# Altium schematic sheet fuelCell_page2.SchDoc
size A4; SheetNumber: 2; SheetTotal: 2
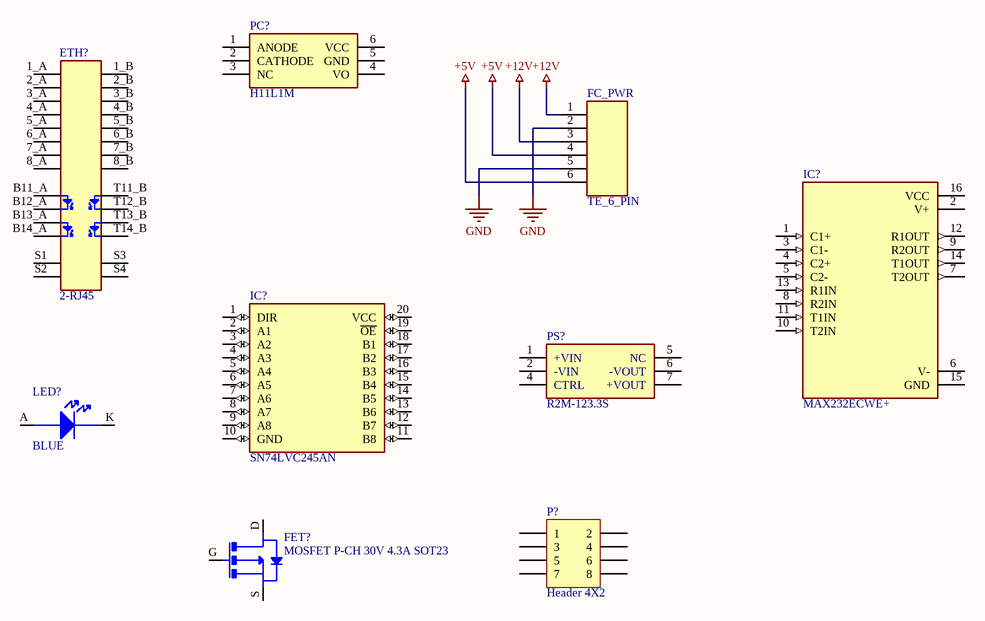
[diagram p0: fuelCell_page2.SchDoc]

## Parts
(Parts that share a designator on the sheet are numbered #1, #2 ... from top to bottom, then left to right.)
ETH?  2-RJ45  [RJ45]
FC_PWR  TE_6_PIN  [TE_6_PIN]
FET?  MOSFET P-CH 30V 4.3A SOT23  [MOSFET P-CH 30V 4.3A SOT23]
IC?#1  MAX232ECWE+  [MAX232ECWE+]
IC?#2  SN74LVC245AN  [SN74LVC245AN]
LED?  BLUE  [LED]
P?  Header 4X2  [HDR2X4]
PC?  H11L1M  [H11L1M]
PS?  R2M-123.3S  [R2M-123.3S]

## Nets
+5V: FC_PWR.4 FC_PWR.6
+12V: FC_PWR.1 FC_PWR.3
GND: FC_PWR.2 FC_PWR.5

Not connected (* = marked no-connect by the designer): ETH? 1_A(+) 1_B(SHIELD) 2_A(+) 2_B(SHIELD) 3_A(+) 3_B(SHIELD) 4_A(+) 4_B(SHIELD) 5_A(+) 5_B(SHIELD) 6_A(+) 6_B(SHIELD) 7_A(+) 7_B(SHIELD) 8_A(+) 8_B(SHIELD) B11_A(9) B12_A(10) B13_A(11) B14_A(12) S1(13) S2(13) S3(SHIELD) S4(SHIELD) T11_B(SHIELD) T12_B(SHIELD) T13_B(B13_B) T14_B(SHIELD); FET? D G S; IC?#1 1(C1+) 2(V+) 3(C1-) 4(C2+) 5(C2-) 6(V-) 7(T2OUT) 8(R2IN) 9(R2OUT) 10(T2IN) 11(T1IN) 12(R1OUT) 13(R1IN) 14(T1OUT) 15(GND) 16(VCC); IC?#2 1(DIR) 2(A1) 3(A2) 4(A3) 5(A4) 6(A5) 7(A6) 8(A7) 9(A8) 10(GND) 11(B8) 12(B7) 13(B6) 14(B5) 15(B4) 16(B3) 17(B2) 18(B1) 19(~{OE}) 20(VCC); LED? A(S) K(S); P? 1 2 3 4 5 6 7 8; PC? 1(SHIELD) 2(SHIELD) 3(SHIELD) 4(SHIELD) 5(SHIELD) 6(SHIELD); PS? 1(+VIN) 2(S) 4(S) 5(S) 6(S) 7(S)

## Notes on the sheet
- (in symbol H11L1M) ANODE; VCC; CATHODE; GND; NC; VO
- (in symbol R2M-123.3S) NC; -VIN; -VOUT; CTRL; +VOUT

## Library data of the parts
ETH? = 2-RJ45: Jack Modular Connector 8p8c (RJ45, Ethernet) 90° Angle (Right) Shielded, EMI Finger Cat5; ComponentLink1Description: Mouser Part; ComponentLink1URL: https://www.mouser.ca/ProductDetail/TRP-Connector-Bel/1840855-3?qs=SRYZG9HaIQ2NEIyvH9raPA%3D%3D
FET? = MOSFET P-CH 30V 4.3A SOT23: P-Channel 30 V 4.3A (Ta) 1.38W (Ta) Surface Mount SOT-23-3
IC?#1 = MAX232ECWE+: RS-232 Interface IC +/-15kV ESD-Protected, +5V RS-232 Transceivers
IC?#2 = SN74LVC245AN: Bus Transceivers Tri-State Octal Bus
LED? = LED
P? = Header 4X2: Header, 4-Pin, Dual row; LatestRevisionDate: 17-Jul-2002; LatestRevisionNote: Re-released for DXP Platform.; Publisher: Altium Limited
PC? = H11L1M: Logic Output Optocouplers Optocoupler LC Schmitt Trigger
PS? = R2M-123.3S: Isolated DC/DC Converters - Through Hole 2W 4.5-18Vin 3.3Vout 500mA